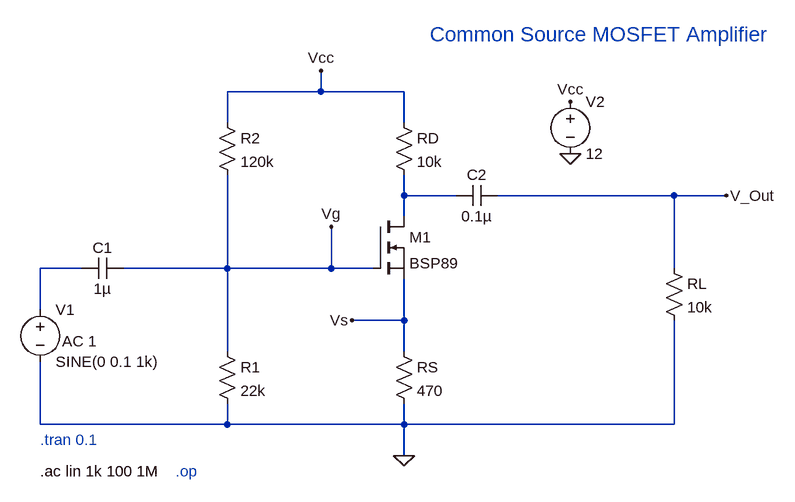
[diagram p0: schematic Mosfet_Amplifier.asc]
Mosfet_Amplifier.asc, the LTspice schematic file:
Version 4.1
SHEET 1 880 680
WIRE 144 -96 144 -128
WIRE 144 -96 0 -96
WIRE 272 -96 144 -96
WIRE 0 -48 0 -96
WIRE 272 -48 272 -96
WIRE 272 64 272 32
WIRE 352 64 272 64
WIRE 688 64 416 64
WIRE 768 64 688 64
WIRE 272 96 272 64
WIRE -224 176 -288 176
WIRE 0 176 0 32
WIRE 0 176 -160 176
WIRE 160 176 160 112
WIRE 160 176 0 176
WIRE 224 176 160 176
WIRE 688 176 688 64
WIRE -288 240 -288 176
WIRE 272 256 272 192
WIRE 272 256 192 256
WIRE 0 304 0 176
WIRE 272 304 272 256
WIRE -288 416 -288 320
WIRE 0 416 0 384
WIRE 0 416 -288 416
WIRE 272 416 272 384
WIRE 272 416 0 416
WIRE 688 416 688 256
WIRE 688 416 272 416
WIRE 272 464 272 416
FLAG 272 464 0
FLAG 528 0 0
FLAG 528 -80 Vcc
FLAG 144 -128 Vcc
FLAG 768 64 V_Out
FLAG 160 112 Vg
FLAG 192 256 Vs
SYMBOL voltage -288 224 R0
WINDOW 123 34 64 Left 2
WINDOW 39 0 0 Left 0
SYMATTR Value2 AC 1
SYMATTR InstName V1
SYMATTR Value SINE(0 0.1 1k)
SYMBOL cap -160 160 R90
WINDOW 0 0 32 VBottom 2
WINDOW 3 32 32 VTop 2
SYMATTR InstName C1
SYMATTR Value 1µ
SYMBOL res 256 288 R0
SYMATTR InstName RS
SYMATTR Value 470
SYMBOL res -16 288 R0
SYMATTR InstName R1
SYMATTR Value 22k
SYMBOL res -16 -64 R0
SYMATTR InstName R2
SYMATTR Value 120k
SYMBOL res 256 -64 R0
SYMATTR InstName RD
SYMATTR Value 10k
SYMBOL voltage 528 -96 R0
WINDOW 123 0 0 Left 0
WINDOW 39 0 0 Left 0
SYMATTR InstName V2
SYMATTR Value 12
SYMBOL cap 416 48 R90
WINDOW 0 0 32 VBottom 2
WINDOW 3 32 32 VTop 2
SYMATTR InstName C2
SYMATTR Value 0.1µ
SYMBOL res 672 160 R0
SYMATTR InstName RL
SYMATTR Value 10k
SYMBOL nmos 224 96 R0
SYMATTR InstName M1
SYMATTR Value BSP89
TEXT -288 488 Left 2 !.ac lin 1k 100 1M
TEXT -288 440 Left 2 ;.tran 0.1
TEXT 312 -184 Left 3 ;Common Source MOSFET Amplifier
TEXT -80 488 Left 2 ;.op

The netlist it stands for:
* Mosfet_Amplifier.asc
V1 N002 0 SINE(0 0.1 1k) AC 1
C1 Vg N002 1µ
RS Vs 0 470
R1 Vg 0 22k
R2 Vcc Vg 120k
RD Vcc N001 10k
V2 Vcc 0 12
C2 V_Out N001 0.1µ
RL V_Out 0 10k
M1 N001 Vg Vs Vs BSP89
.model NMOS NMOS
.model PMOS PMOS
.lib standard.mos
.ac lin 1k 100 1M
* .tran 0.1
* Common Source MOSFET Amplifier
* .op
.backanno
.end